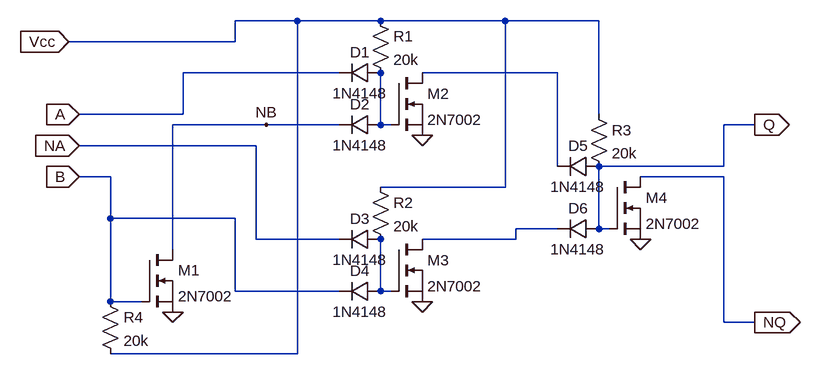
[diagram p0: schematic nxor.asc]
nxor.asc, the LTspice schematic file:
Version 4
SHEET 1 880 680
WIRE -64 48 -160 48
WIRE 64 48 -64 48
WIRE 256 48 64 48
WIRE 400 48 256 48
WIRE -160 80 -160 48
WIRE -160 80 -416 80
WIRE 0 128 -240 128
WIRE 336 128 128 128
WIRE -240 192 -240 128
WIRE -240 192 -400 192
WIRE 400 192 400 48
WIRE -112 208 -256 208
WIRE 0 208 -112 208
WIRE 64 208 64 128
WIRE 80 208 64 208
WIRE 640 208 592 208
WIRE -128 240 -400 240
WIRE 336 272 336 128
WIRE 592 272 592 208
WIRE 592 272 400 272
WIRE -352 288 -400 288
WIRE 592 288 464 288
WIRE 256 304 256 48
WIRE 256 304 64 304
WIRE -352 352 -352 288
WIRE -160 352 -352 352
WIRE 336 368 272 368
WIRE 400 368 400 272
WIRE 416 368 400 368
WIRE -128 384 -128 240
WIRE 0 384 -128 384
WIRE 272 384 272 368
WIRE 272 384 128 384
WIRE -256 400 -256 208
WIRE -160 464 -160 352
WIRE 0 464 -160 464
WIRE 64 464 64 384
WIRE 80 464 64 464
WIRE -352 480 -352 352
WIRE -304 480 -352 480
WIRE 592 512 592 288
WIRE 640 512 592 512
WIRE -64 560 -64 48
WIRE -64 560 -352 560
FLAG -400 192 A
IOPIN -400 192 In
FLAG -400 240 NA
IOPIN -400 240 In
FLAG -400 288 B
IOPIN -400 288 In
FLAG 640 208 Q
IOPIN 640 208 Out
FLAG 640 512 NQ
IOPIN 640 512 Out
FLAG -256 496 0
FLAG -416 80 Vcc
IOPIN -416 80 In
FLAG 128 480 0
FLAG 128 224 0
FLAG 464 384 0
FLAG -112 208 NB
SYMBOL diode 64 112 R90
WINDOW 0 0 32 VBottom 2
WINDOW 3 32 32 VTop 2
SYMATTR InstName D1
SYMATTR Value 1N4148
SYMBOL nmos -304 400 R0
SYMATTR InstName M1
SYMATTR Value 2N7002
SYMBOL diode 64 192 R90
WINDOW 0 0 32 VBottom 2
WINDOW 3 32 32 VTop 2
SYMATTR InstName D2
SYMATTR Value 1N4148
SYMBOL diode 64 368 R90
WINDOW 0 0 32 VBottom 2
WINDOW 3 32 32 VTop 2
SYMATTR InstName D3
SYMATTR Value 1N4148
SYMBOL diode 64 448 R90
WINDOW 0 0 32 VBottom 2
WINDOW 3 32 32 VTop 2
SYMATTR InstName D4
SYMATTR Value 1N4148
SYMBOL diode 400 256 R90
WINDOW 0 0 32 VBottom 2
WINDOW 3 32 32 VTop 2
SYMATTR InstName D5
SYMATTR Value 1N4148
SYMBOL diode 400 352 R90
WINDOW 0 0 32 VBottom 2
WINDOW 3 32 32 VTop 2
SYMATTR InstName D6
SYMATTR Value 1N4148
SYMBOL nmos 80 128 R0
SYMATTR InstName M2
SYMATTR Value 2N7002
SYMBOL nmos 80 384 R0
SYMATTR InstName M3
SYMATTR Value 2N7002
SYMBOL nmos 416 288 R0
SYMATTR InstName M4
SYMATTR Value 2N7002
SYMBOL res 48 32 R0
SYMATTR InstName R1
SYMATTR Value 20k
SYMBOL res 48 288 R0
SYMATTR InstName R2
SYMATTR Value 20k
SYMBOL res 384 176 R0
SYMATTR InstName R3
SYMATTR Value 20k
SYMBOL res -368 464 R0
SYMATTR InstName R4
SYMATTR Value 20k

The netlist it stands for:
* nxor.asc
D1 N002 A 1N4148
M1 NB B 0 0 2N7002
D2 N002 NB 1N4148
D3 N004 NA 1N4148
D4 N004 B 1N4148
D5 Q N001 1N4148
D6 Q N003 1N4148
M2 N001 N002 0 0 2N7002
M3 N003 N004 0 0 2N7002
M4 NQ Q 0 0 2N7002
R1 Vcc N002 20k
R2 Vcc N004 20k
R3 Vcc Q 20k
R4 B Vcc 20k
.model D D
.lib standard.dio
.model NMOS NMOS
.model PMOS PMOS
.lib standard.mos
.backanno
.end